# Altium schematic sheet PLC1_4.SchDoc
size 420 x 297 mm; SheetNumber: 4; Scale: {Масш.}; Title1str: {Наименование}; PageSetup: Record=PageOptions|CenterHorizontal=False|CenterVertical=False|PrintScale=0.67|XCorrection=0.00|YCorrection=0.00|PrintKind=1|BorderSize=5000000|LeftOffset=0|BottomOffset=0|Orientation=2|PaperLength=1000|PaperWidth=1000|Scale=100|PaperSource=7|PrintQuality=600|MediaType=1|DitherType=10|PaperKind=A4|PrintScaleMode=1; Title2str: {Наименование}; ProcessInspection: {Т.контр.}; Mass: {Масса}; NormInspection: {Н.контр.}; EngineerName: {Инженер}; Letter1Column: {}; Letter2Column: {}; Letter3Column: {}; DocumentType: ?????????????? ?????; DocumentType1str: {Документ}; DocumentType2str: {Документ}
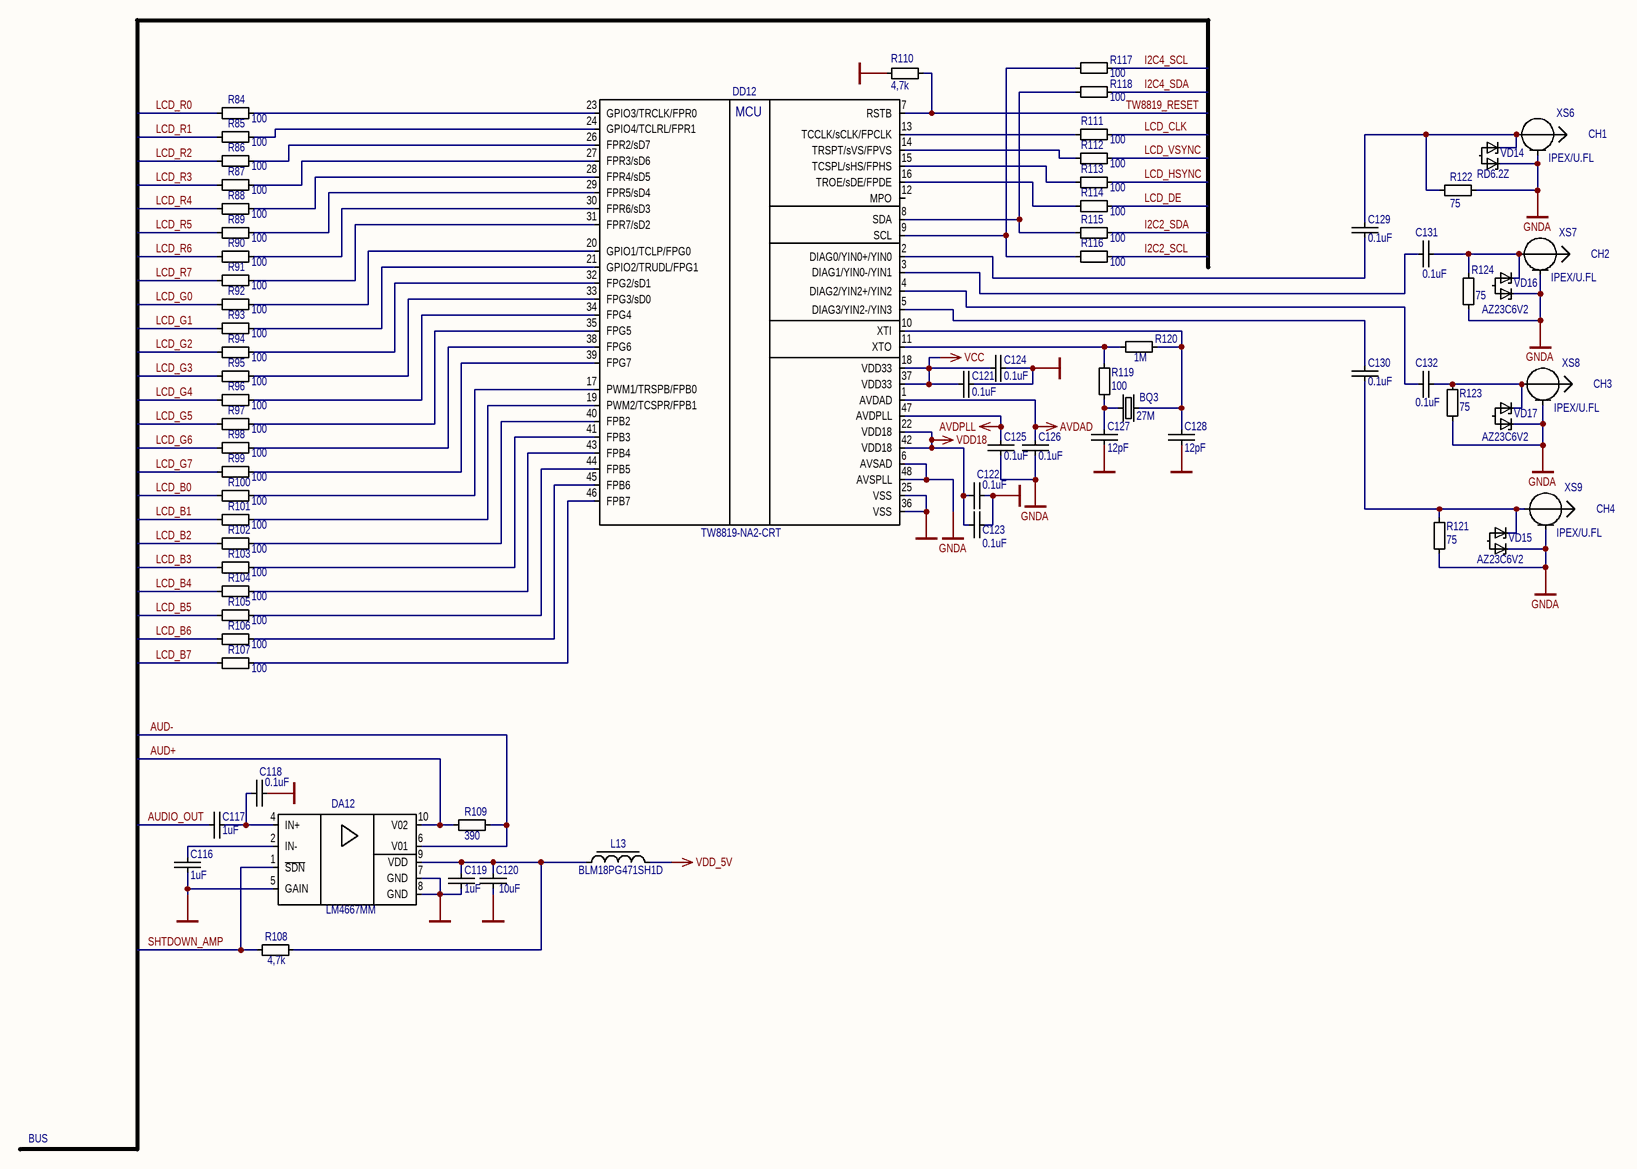
[diagram p0: PLC1_4.SchDoc]

## Parts
BQ3  value 27M  [TSX-3225]  (hidden comment: TSX-3225)
C116  1uF  [CAP_0603]
C117  1uF  [CAP_0603]
C118  0.1uF  [CAP_0603]
C119  1uF  [CAP_0603]
C120  10uF  [C_0805]
C121  0.1uF  [CAP_0603]
C122  0.1uF  [CAP_0603]
C123  0.1uF  [CAP_0603]
C124  0.1uF  [CAP_0603]
C125  0.1uF  [CAP_0603]
C126  0.1uF  [CAP_0603]
C127  12pF  [CAP_0603]
C128  12pF  [CAP_0603]
C129  0.1uF  [CAP_0603]
C130  0.1uF  [CAP_0603]
C131  0.1uF  [CAP_0603]
C132  0.1uF  [CAP_0603]
DA12  value LM4667MM  [S-PDSO-G10]  (hidden comment: LM4667MM/NOPB)
DD12  TW8819-NA2-CRT  [QFN48.7x7]
L13  BLM18PG471SH1D  [R_IND_0603]
R84  value 100  [RES_0402]  (hidden comment: Res_0402)
R85  value 100  [RES_0402]  (hidden comment: Res_0402)
R86  value 100  [RES_0402]  (hidden comment: Res_0402)
R87  value 100  [RES_0402]  (hidden comment: Res_0402)
R88  value 100  [RES_0402]  (hidden comment: Res_0402)
R89  value 100  [RES_0402]  (hidden comment: Res_0402)
R90  value 100  [RES_0402]  (hidden comment: Res_0402)
R91  value 100  [RES_0402]  (hidden comment: Res_0402)
R92  value 100  [RES_0402]  (hidden comment: Res_0402)
R93  value 100  [RES_0402]  (hidden comment: Res_0402)
R94  value 100  [RES_0402]  (hidden comment: Res_0402)
R95  value 100  [RES_0402]  (hidden comment: Res_0402)
R96  value 100  [RES_0402]  (hidden comment: Res_0402)
R97  value 100  [RES_0402]  (hidden comment: Res_0402)
R98  value 100  [RES_0402]  (hidden comment: Res_0402)
R99  value 100  [RES_0402]  (hidden comment: Res_0402)
R100  value 100  [RES_0402]  (hidden comment: Res_0402)
R101  value 100  [RES_0402]  (hidden comment: Res_0402)
R102  value 100  [RES_0402]  (hidden comment: Res_0402)
R103  value 100  [RES_0402]  (hidden comment: Res_0402)
R104  value 100  [RES_0402]  (hidden comment: Res_0402)
R105  value 100  [RES_0402]  (hidden comment: Res_0402)
R106  value 100  [RES_0402]  (hidden comment: Res_0402)
R107  value 100  [RES_0402]  (hidden comment: Res_0402)
R108  4,7k  [RES_0603]
R109  390  [RES_0603]
R110  4,7k  [RES_0603]
R111  value 100  [RES_0402]  (hidden comment: Res_0402)
R112  value 100  [RES_0402]  (hidden comment: Res_0402)
R113  value 100  [RES_0402]  (hidden comment: Res_0402)
R114  value 100  [RES_0402]  (hidden comment: Res_0402)
R115  value 100  [RES_0402]  (hidden comment: Res_0402)
R116  value 100  [RES_0402]  (hidden comment: Res_0402)
R117  value 100  [RES_0402]  (hidden comment: Res_0402)
R118  value 100  [RES_0402]  (hidden comment: Res_0402)
R119  value 100  [RES_0402]  (hidden comment: Res_0402)
R120  value 1M  [RES_0402]  (hidden comment: Res_0402)
R121  75  [RES_0603]
R122  75  [RES_0603]
R123  75  [RES_0603]
R124  75  [RES_0603]
VD14  RD6.2Z  [SC-59]
VD15  Part Number: AZ23C6V2  [SC-59]  (hidden comment: RD6.2Z)
VD16  Part Number: AZ23C6V2  [SC-59]  (hidden comment: RD6.2Z)
VD17  Part Number: AZ23C6V2  [SC-59]  (hidden comment: RD6.2Z)
XS6  IPEX/U.FL  [IPEX MHFI]
XS7  IPEX/U.FL  [IPEX MHFI]
XS8  IPEX/U.FL  [IPEX MHFI]
XS9  IPEX/U.FL  [IPEX MHFI]

## Nets
AVDAD: C126.1 DD12.1(AVDAD)
AVDPLL: C125.1 DD12.47(AVDPLL)
GND: C116.1 C118.2 C119.1 C120.1 C121.2 C122.2 C123.2 C124.2 C127.1 C128.1 DA12.5(GAIN) DA12.7(GND) DA12.8(GND) DD12.25(VSS) DD12.36(VSS) R110.2
GNDA: C125.2 C126.2 DD12.6(AVSAD) DD12.48(AVSPLL) R121.1 R122.2 R123.1 R124.2 VD14.2 VD15.2 VD16.2 VD17.2 XS6.2 XS7.2 XS8.2 XS9.2
VCC: C121.1 C124.1 DD12.18(VDD33) DD12.37(VDD33)
VDD18: C122.1 C123.1 DD12.22(VDD18) DD12.42(VDD18)
VDD_5V: L13.1
AUD+: DA12.10(V02) R109.2
AUD-: DA12.6(V01) R109.1
AUDIO_OUT: C117.2
I2C2_SCL: R116.2
I2C2_SDA: R115.2
I2C4_SCL: R117.2
I2C4_SDA: R118.2
LCD_B0: R100.2
LCD_B1: R101.2
LCD_B2: R102.2
LCD_B3: R103.2
LCD_B4: R104.2
LCD_B5: R105.2
LCD_B6: R106.2
LCD_B7: R107.2
LCD_CLK: R111.2
LCD_DE: R114.2
LCD_G0: R92.2
LCD_G1: R93.2
LCD_G2: R94.2
LCD_G3: R95.2
LCD_G4: R96.2
LCD_G5: R97.2
LCD_G6: R98.2
LCD_G7: R99.2
LCD_HSYNC: R113.2
LCD_R0: R84.2
LCD_R1: R85.2
LCD_R2: R86.2
LCD_R3: R87.2
LCD_R4: R88.2
LCD_R5: R89.2
LCD_R6: R90.2
LCD_R7: R91.2
LCD_VSYNC: R112.2
SHTDOWN_AMP: DA12.1(~{SDN}) R108.1
TW8819_RESET: DD12.7(RSTB) R110.1
NetBQ3_1: BQ3.1 C128.2 DD12.10(XTI) R120.1
NetBQ3_2: BQ3.2 C127.2 R119.1
NetC116_2: C116.2 DA12.2(IN-)
NetC117_1: C117.1 C118.1 DA12.4(IN+)
NetC119_2: C119.2 C120.2 DA12.9(VDD) L13.2 R108.2
NetC129_1: C129.1 R122.1 VD14.1 XS6.1
NetC129_2: C129.2 DD12.2(DIAG0/YIN0+/YIN0)
NetC130_1: C130.1 DD12.5(DIAG3/YIN2-/YIN3)
NetC130_2: C130.2 R121.2 VD15.1 XS9.1
NetC131_1: C131.1 DD12.3(DIAG1/YIN0-/YIN1)
NetC131_2: C131.2 R124.1 VD16.1 XS7.1
NetC132_1: C132.1 DD12.4(DIAG2/YIN2+/YIN2)
NetC132_2: C132.2 R123.2 VD17.1 XS8.1
NetDD12_8: DD12.8(SDA) R115.1 R118.1
NetDD12_9: DD12.9(SCL) R116.1 R117.1
NetDD12_11: DD12.11(XTO) R119.2 R120.2
NetDD12_13: DD12.13(TCCLK/sCLK/FPCLK) R111.1
NetDD12_14: DD12.14(TRSPT/sVS/FPVS) R112.1
NetDD12_15: DD12.15(TCSPL/sHS/FPHS) R113.1
NetDD12_16: DD12.16(TROE/sDE/FPDE) R114.1
NetDD12_17: DD12.17(PWM1/TRSPB/FPB0) R100.1
NetDD12_19: DD12.19(PWM2/TCSPR/FPB1) R101.1
NetDD12_20: DD12.20(GPIO1/TCLP/FPG0) R92.1
NetDD12_21: DD12.21(GPIO2/TRUDL/FPG1) R93.1
NetDD12_23: DD12.23(GPIO3/TRCLK/FPR0) R84.1
NetDD12_24: DD12.24(GPIO4/TCLRL/FPR1) R85.1
NetDD12_26: DD12.26(FPR2/sD7) R86.1
NetDD12_27: DD12.27(FPR3/sD6) R87.1
NetDD12_28: DD12.28(FPR4/sD5) R88.1
NetDD12_29: DD12.29(FPR5/sD4) R89.1
NetDD12_30: DD12.30(FPR6/sD3) R90.1
NetDD12_31: DD12.31(FPR7/sD2) R91.1
NetDD12_32: DD12.32(FPG2/sD1) R94.1
NetDD12_33: DD12.33(FPG3/sD0) R95.1
NetDD12_34: DD12.34(FPG4) R96.1
NetDD12_35: DD12.35(FPG5) R97.1
NetDD12_38: DD12.38(FPG6) R98.1
NetDD12_39: DD12.39(FPG7) R99.1
NetDD12_40: DD12.40(FPB2) R102.1
NetDD12_41: DD12.41(FPB3) R103.1
NetDD12_43: DD12.43(FPB4) R104.1
NetDD12_44: DD12.44(FPB5) R105.1
NetDD12_45: DD12.45(FPB6) R106.1
NetDD12_46: DD12.46(FPB7) R107.1

Not connected (* = marked no-connect by the designer): DD12 12(MPO); VD14 3; VD15 3; VD16 3; VD17 3

## Notes on the sheet
- (near XS6) CH1
- (near XS7) CH2
- (near XS8) CH3
- (near XS9) CH4
- BUS
- Подп. и дата
- Инв. № дубл.
- Взам. инв. №
- Инв. № подл.
- Изм.
- Лист
- № докум.
- Подп.
- Дата
- 2.106-A3
- Копировал
- Формат А3
- (in symbol TW8819-NA2-CRT) MCU

## Library data of the parts
BQ3 = TSX-3225: Manufacturer: EPSON; Part Number: EPSON TSX-3225 27.0000MF10Z-K3; Replacement: TSX-3225 27.0000MF10Z-AC0-ND; PackageReference: TSX-3225
C116 C117 C119 = Cap_0603: Manufacturer: AVX; Part Number: 0603YC105KAT2A; Replacement: 0603YD105KAT2A; PackageReference: 0603; Value: 1uF; Distributor: http://www.rospek.ru; Price: 0.001$
C118 C121-C126 C129-C132 = Cap_0603: Manufacturer: AVX; Part Number: 0603YC104KAT2A; Replacement: GRM188R71E104KA12D; PackageReference: 0603; Value: 0.1uF; Distributor: http://www.rospek.ru; Price: 0.001$
C120 = Cap_0805: Manufacturer: Murata; Part Number: GRM21BR61E106KA73L; Replacement: 0805 16V X7R; PackageReference: 0805; Value: 10uF; Price: 0.01$
C127 C128 = Cap_0603: Manufacturer: Murata; Part Number: GRM1885C1H120JA01D; Replacement: 12pF 0603 NP0; PackageReference: 0603; Value: 12pF; Distributor: http://www.rospek.ru; Price: 0.001$
DA12 = LM4667MM/NOPB: Manufacturer: TEXAS INSTRUMENTS; Price: 0.6$; Distributor: TE; Replacement: LM4667MM/NOPB; PackageReference: VSSOP-10; Part Number: LM4667MM/NOPB
DD12 = TW8819-NA2-CRT: Manufacturer: Intersil; Price: 4.00$; Replacement: TW8819-NA2-CRT; PackageReference: WFQFN; TW8819-NA2-CRT: TW8819-NA2-CRT; Type: power
L13 = FCM1608KF-601T03: Manufacturer: Murata; Replacement: 600 ohm @100 MHz; PackageReference: 0603; Part Number: BLM18PG471SH1D; Distributor: http://www.chipdip.ru; Price: 0.1$; Value: BLM18PG471SH1D
R84-R107 R111-R119 = Res_0402: 0402; Manufacturer: BOURNS; Part Number: CR0402-FX-1000GLF; Replacement: 0402 100 Ohm 5%; PackageReference: 0402; Distributor: http://www.kontest.ru; Price: 0.01$
R108 R110 = Res_0603: 0603, 100; Manufacturer: Vishay; Part Number: CRCW0603-472JRT1; Replacement: 0603 4.7 kOhm 5%; PackageReference: 0603; Value: 4,7k; Distributor: http://www.kontest.ru; Price: 0.01$
R109 = Res_0603: 0603, 390; Manufacturer: YAGEO; Part Number: RC0603FR-07390RL; Replacement: 0603 390 5%; PackageReference: 0603; Value: 390; Price: 0.004$
R120 = Res_0402: 0402; Manufacturer: BOURNS; Part Number: RC0402JR-071ML; Replacement: 0402 1 MOhm 5%; PackageReference: 0402; Distributor: http://www.kontest.ru; Price: 0.01$
R121-R124 = Res_0603: 0603; Manufacturer: YAGEO; Part Number: RC0603JR-0775RL; Replacement: 0603 75 Ohm 5%; PackageReference: 0603; Distributor: http://www.kontest.ru; Price: 0.01$; Value: 75
VD14-VD17 = RD6.2Z: Manufacturer: NEC; Price: 0.1$
  VD14: Part Number: RD6.2Z
  VD15-VD17: Replacement: RD6.2Z
XS6-XS9 = IPEX/U.FL: IPEX/U.FL male pcb SMT; Manufacturer: taoglas limited; Part Number: 20279-001E-01; Replacement: J983TR-ND; PackageReference: IPEX/U.FL